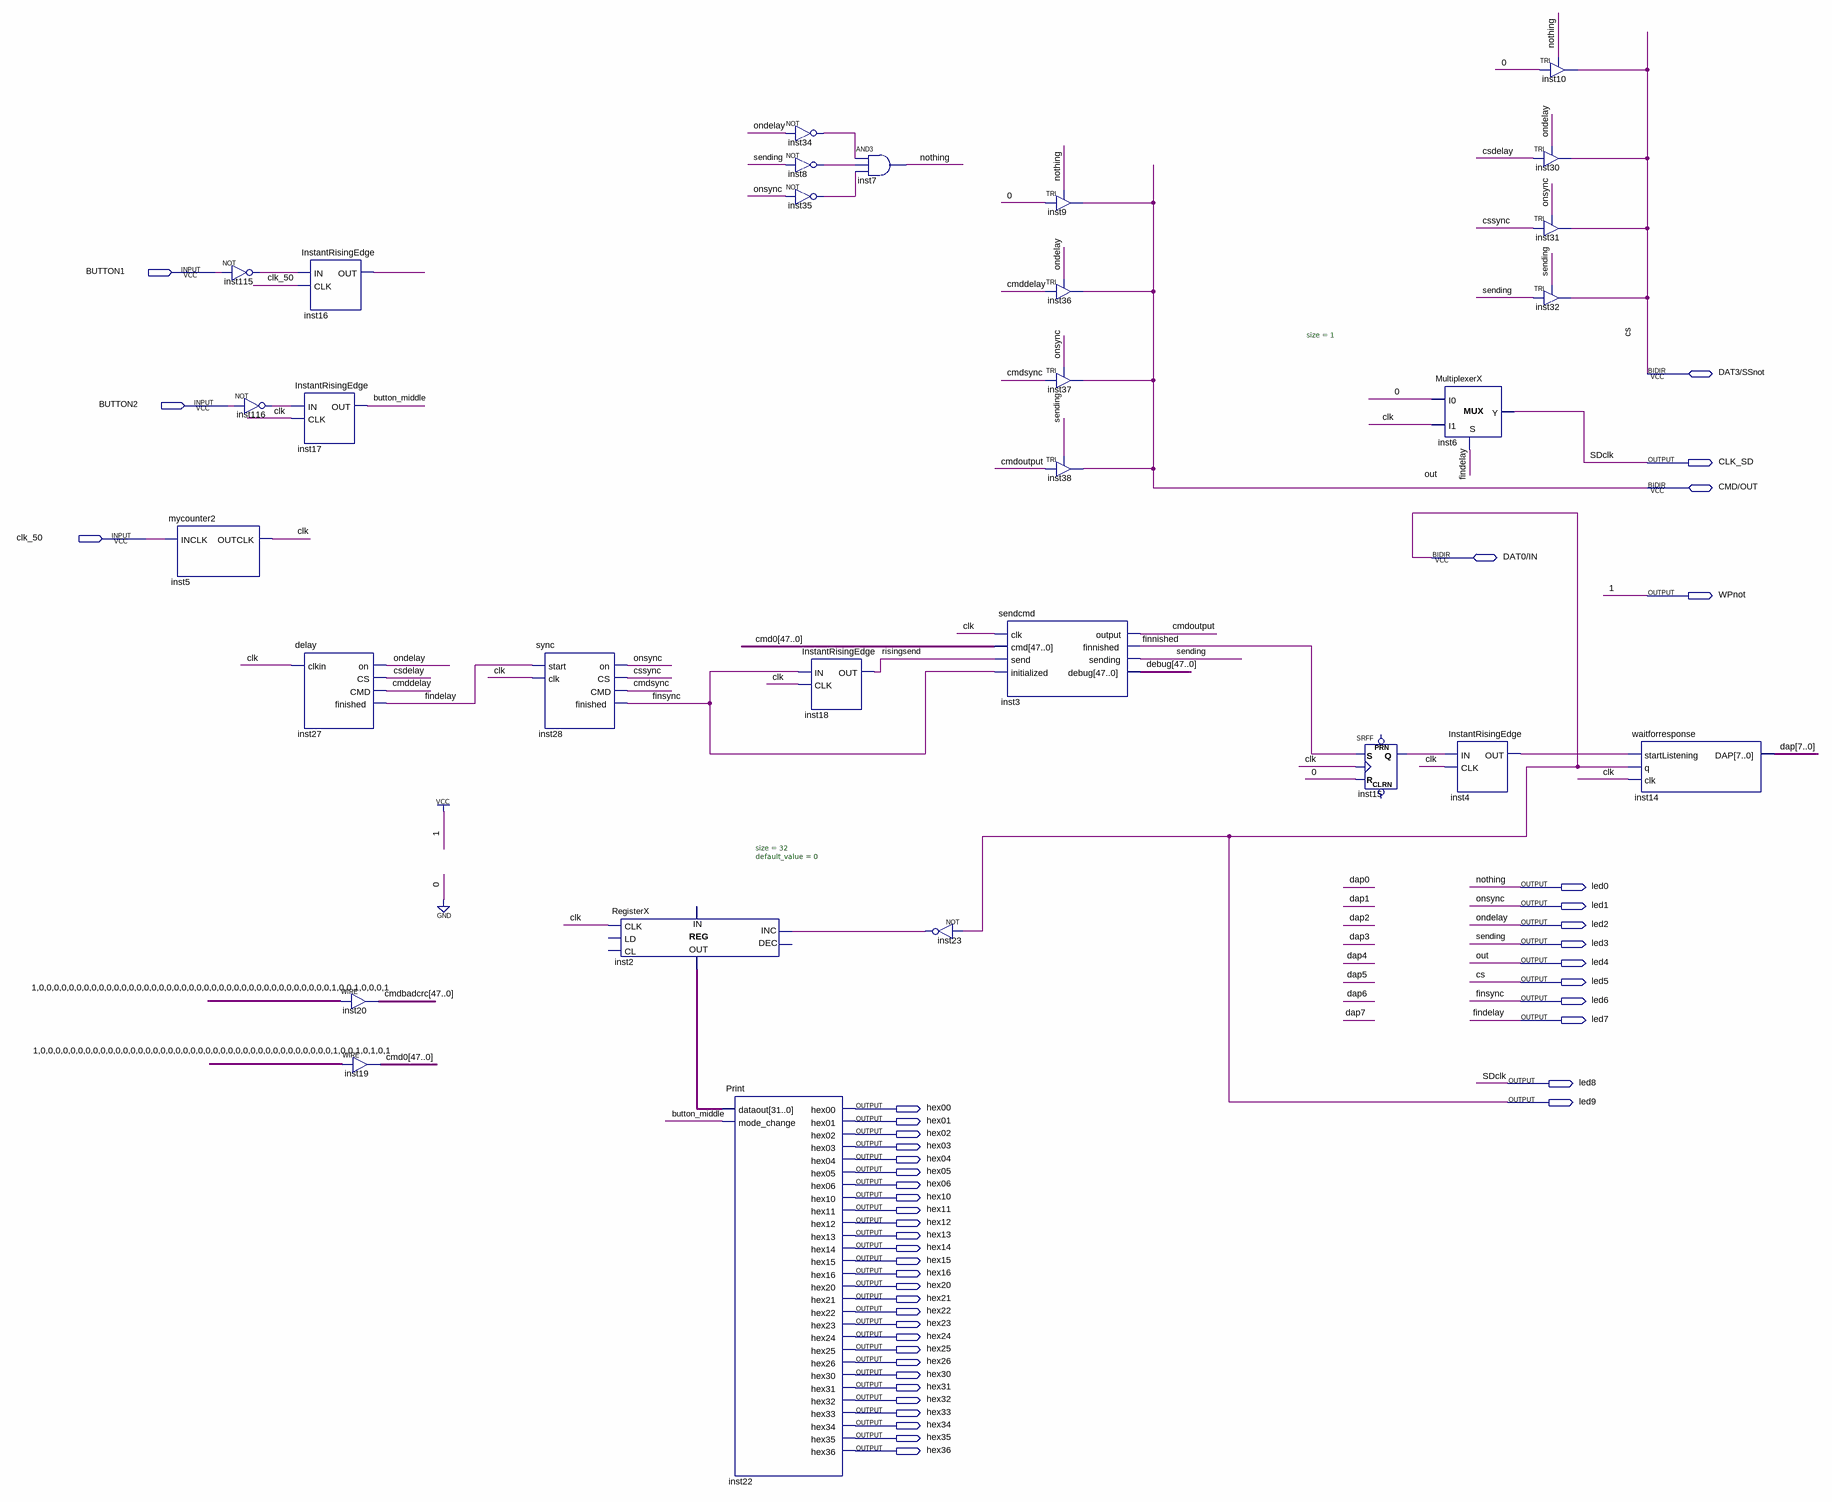
[diagram p0: schematic sheet]
// Quartus schematic sdcard.bdf as structural Verilog: 30 symbols, 46 pins
module sdcard (
  input  BUTTON1,
  input  BUTTON2,
  input  clk_50,
  inout  \DAT3/SSnot ,
  inout  \CMD/OUT ,
  inout  \DAT0/IN ,
  output CLK_SD,
  output WPnot,
  output led0,
  output led1,
  output led2,
  output led3,
  output led4,
  output led5,
  output led6,
  output led7,
  output led8,
  output led9,
  output hex00,
  output hex01,
  output hex02,
  output hex03,
  output hex04,
  output hex05,
  output hex06,
  output hex10,
  output hex11,
  output hex12,
  output hex13,
  output hex14,
  output hex15,
  output hex16,
  output hex20,
  output hex21,
  output hex22,
  output hex23,
  output hex24,
  output hex25,
  output hex26,
  output hex30,
  output hex31,
  output hex32,
  output hex33,
  output hex34,
  output hex35,
  output hex36
);

  wire button_middle, clk, cmddelay, cmdoutput, cmdsync, csdelay, cssync, finnished, inst4_out, inst8_out,
       inst15_q, inst16_out, inst23_out, inst34_out, inst35_out, inst115_out, inst116_out, risingsend;
  wire [7:0] dap;
  wire [31:0] inst2_data_out;
  wire [47:0] cmd0, cmdbadcrc, debug;

  mycounter2 inst5 (.INCLK(clk_50), .OUTCLK(clk));
  not inst115 (inst115_out, BUTTON1);
  not inst116 (inst116_out, BUTTON2);
  InstantRisingEdge inst16 (.IN(inst115_out), .CLK(clk_50), .OUT(inst16_out));
  InstantRisingEdge inst17 (.IN(inst116_out), .CLK(clk), .OUT(button_middle));
  delay inst27 (.clkin(clk), .on(led2), .CS(csdelay), .CMD(cmddelay), .finished(led7));
  assign cmdbadcrc = 48'b100000000000000000000000000000000000000010010001;  // WIRE inst20
  assign cmd0 = 48'b100000000000000000000000000000000000000010010101;  // WIRE inst19
  sync inst28 (.start(led7), .clk(clk), .on(led1), .CS(cssync), .CMD(cmdsync), .finished(led6));
  RegisterX #(.size(32), .default_value(0)) inst2 (
    .CLK(clk), .INC(inst23_out), .DATA_OUT(inst2_data_out));  // open: LD, CL, DEC, DATA_IN
  Print inst22 (
    .dataout(inst2_data_out), .mode_change(button_middle), .hex00(hex00), .hex01(hex01), .hex02(hex02),
    .hex03(hex03), .hex04(hex04), .hex05(hex05), .hex06(hex06), .hex10(hex10), .hex11(hex11), .hex12(hex12),
    .hex13(hex13), .hex14(hex14), .hex15(hex15), .hex16(hex16), .hex20(hex20), .hex21(hex21), .hex22(hex22),
    .hex23(hex23), .hex24(hex24), .hex25(hex25), .hex26(hex26), .hex30(hex30), .hex31(hex31), .hex32(hex32),
    .hex33(hex33), .hex34(hex34), .hex35(hex35), .hex36(hex36));
  not inst34 (inst34_out, led2);
  not inst8 (inst8_out, led3);
  not inst35 (inst35_out, led1);
  InstantRisingEdge inst18 (.IN(led6), .CLK(clk), .OUT(risingsend));
  and inst7 (led0, inst34_out, inst8_out, inst35_out);
  not inst23 (inst23_out, \DAT0/IN );
  sendcmd inst3 (
    .clk(clk), .cmd(cmd0), .send(risingsend), .initialized(led6), .\output (cmdoutput),
    .finnished(finnished), .sending(led3), .debug(debug));
  TRI inst9 (.IN(1'b0), .OE(led0), .OUT(\CMD/OUT ));
  TRI inst36 (.IN(cmddelay), .OE(led2), .OUT(\CMD/OUT ));
  TRI inst37 (.IN(cmdsync), .OE(led1), .OUT(\CMD/OUT ));
  TRI inst38 (.IN(cmdoutput), .OE(led3), .OUT(\CMD/OUT ));
  SRFF inst15 (.S(finnished), .R(1'b0), .CLK(clk), .Q(inst15_q));  // open: PRN, CLRN
  MultiplexerX #(.size(1)) inst6 (.S(led7), .I0(1'b0), .I1(clk), .Y(CLK_SD));
  InstantRisingEdge inst4 (.IN(inst15_q), .CLK(clk), .OUT(inst4_out));
  TRI inst10 (.IN(1'b0), .OE(led0), .OUT(\DAT3/SSnot ));
  TRI inst30 (.IN(csdelay), .OE(led2), .OUT(\DAT3/SSnot ));
  TRI inst31 (.IN(cssync), .OE(led1), .OUT(\DAT3/SSnot ));
  TRI inst32 (.IN(led3), .OE(led3), .OUT(\DAT3/SSnot ));
  waitforresponse inst14 (.startListening(inst4_out), .q(\DAT0/IN ), .clk(clk), .DAP(dap));

  assign led4 = \CMD/OUT ;
  assign led5 = \DAT3/SSnot ;
  assign led8 = CLK_SD;
  assign led9 = \DAT0/IN ;
  assign WPnot = 1'b1;

  // Other names for the same wires on the sheet: cs = \DAT3/SSnot ; findelay = led7; finsync = led6; nothing = led0;
  //   ondelay = led2; onsync = led1; out = \CMD/OUT ; SDclk = CLK_SD; sending = led3
endmodule
